# Altium schematic sheet 19_SOLENOID_HB_2.SchDoc
size 420 x 297 mm; SheetNumber: 32; SheetTotal: 36
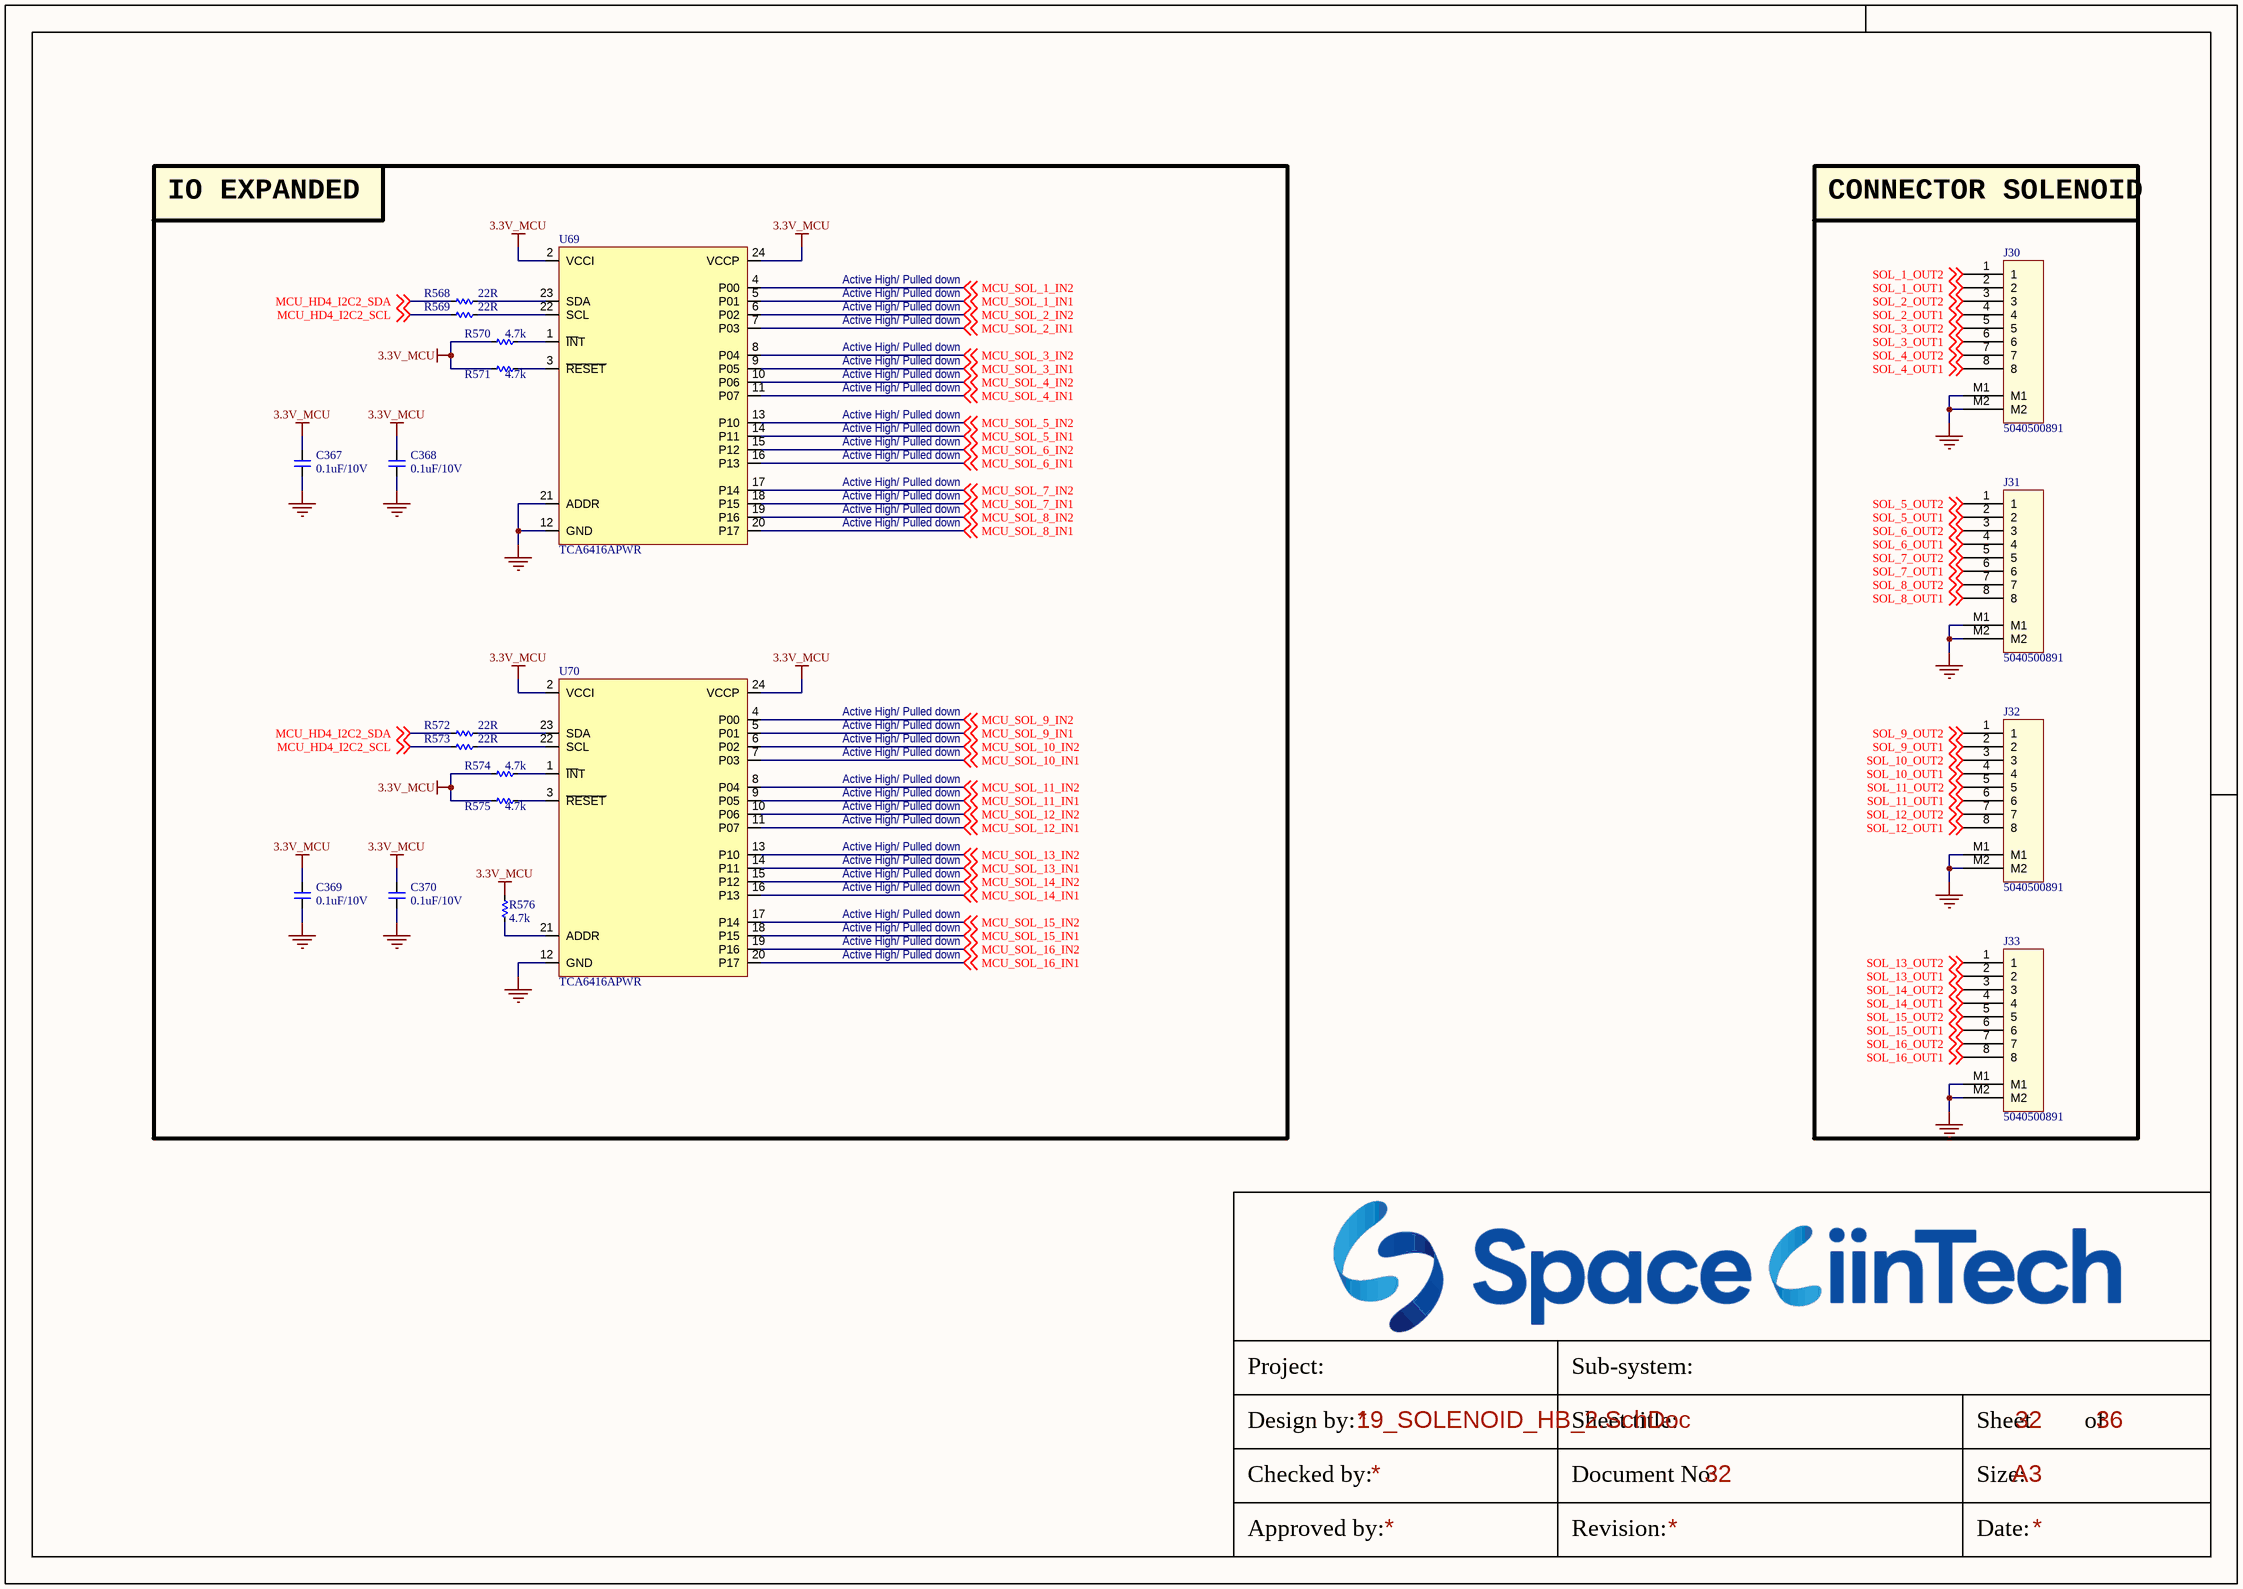
[diagram p0: 19_SOLENOID_HB_2.SchDoc]

## Parts
C367  0.1uF/10V  [CAP_C_1005X50_L]
C368  0.1uF/10V  [CAP_C_1005X50_L]
C369  0.1uF/10V  [CAP_C_1005X50_L]
C370  0.1uF/10V  [CAP_C_1005X50_L]
J30  5040500891  [MOLEX_5040500891]
J31  5040500891  [MOLEX_5040500891]
J32  5040500891  [MOLEX_5040500891]
J33  5040500891  [MOLEX_5040500891]
R568  22R  [RES_C_1005x30_L]
R569  22R  [RES_C_1005x30_L]
R570  4.7k  [RES_C_1005x30_L]
R571  4.7k  [RES_C_1005x30_L]
R572  22R  [RES_C_1005x30_L]
R573  22R  [RES_C_1005x30_L]
R574  4.7k  [RES_C_1005x30_L]
R575  4.7k  [RES_C_1005x30_L]
R576  4.7k  [RES_C_1005x30_L]
U69  TCA6416APWR  [SOP65P440W-24N]
U70  TCA6416APWR  [SOP65P440W-24N]

## Blocks framed on the sheet
IO EXPANDED: C367-C370 R568-R576 U69 U70
CONNECTOR SOLENOID: J30-J33

## Nets
3.3V_MCU: C367.2 C368.2 C369.2 C370.2 R570.1 R571.1 R574.1 R575.1 R576.2 U69.2(VCCI) U69.24(VCCP) U70.2(VCCI) U70.24(VCCP)
GND: C367.1 C368.1 C369.1 C370.1 J30.M1 J30.M2 J31.M1 J31.M2 J32.M1 J32.M2 J33.M1 J33.M2 U69.12(GND) U69.21(ADDR) U70.12(GND)
MCU_HD4_I2C2_SCL: R569.1 R573.1 ; off-sheet MCU_HD4_I2C2_SCL
MCU_HD4_I2C2_SDA: R568.1 R572.1 ; off-sheet MCU_HD4_I2C2_SDA
MCU_SOL_1_IN1: U69.5(P01) ; off-sheet MCU_SOL_1_IN1
MCU_SOL_1_IN2: U69.4(P00) ; off-sheet MCU_SOL_1_IN2
MCU_SOL_2_IN1: U69.7(P03) ; off-sheet MCU_SOL_2_IN1
MCU_SOL_2_IN2: U69.6(P02) ; off-sheet MCU_SOL_2_IN2
MCU_SOL_3_IN1: U69.9(P05) ; off-sheet MCU_SOL_3_IN1
MCU_SOL_3_IN2: U69.8(P04) ; off-sheet MCU_SOL_3_IN2
MCU_SOL_4_IN1: U69.11(P07) ; off-sheet MCU_SOL_4_IN1
MCU_SOL_4_IN2: U69.10(P06) ; off-sheet MCU_SOL_4_IN2
MCU_SOL_5_IN1: U69.14(P11) ; off-sheet MCU_SOL_5_IN1
MCU_SOL_5_IN2: U69.13(P10) ; off-sheet MCU_SOL_5_IN2
MCU_SOL_6_IN1: U69.16(P13) ; off-sheet MCU_SOL_6_IN1
MCU_SOL_6_IN2: U69.15(P12) ; off-sheet MCU_SOL_6_IN2
MCU_SOL_7_IN1: U69.18(P15) ; off-sheet MCU_SOL_7_IN1
MCU_SOL_7_IN2: U69.17(P14) ; off-sheet MCU_SOL_7_IN2
MCU_SOL_8_IN1: U69.20(P17) ; off-sheet MCU_SOL_8_IN1
MCU_SOL_8_IN2: U69.19(P16) ; off-sheet MCU_SOL_8_IN2
MCU_SOL_9_IN1: U70.5(P01) ; off-sheet MCU_SOL_9_IN1
MCU_SOL_9_IN2: U70.4(P00) ; off-sheet MCU_SOL_9_IN2
MCU_SOL_10_IN1: U70.7(P03) ; off-sheet MCU_SOL_10_IN1
MCU_SOL_10_IN2: U70.6(P02) ; off-sheet MCU_SOL_10_IN2
MCU_SOL_11_IN1: U70.9(P05) ; off-sheet MCU_SOL_11_IN1
MCU_SOL_11_IN2: U70.8(P04) ; off-sheet MCU_SOL_11_IN2
MCU_SOL_12_IN1: U70.11(P07) ; off-sheet MCU_SOL_12_IN1
MCU_SOL_12_IN2: U70.10(P06) ; off-sheet MCU_SOL_12_IN2
MCU_SOL_13_IN1: U70.14(P11) ; off-sheet MCU_SOL_13_IN1
MCU_SOL_13_IN2: U70.13(P10) ; off-sheet MCU_SOL_13_IN2
MCU_SOL_14_IN1: U70.16(P13) ; off-sheet MCU_SOL_14_IN1
MCU_SOL_14_IN2: U70.15(P12) ; off-sheet MCU_SOL_14_IN2
MCU_SOL_15_IN1: U70.18(P15) ; off-sheet MCU_SOL_15_IN1
MCU_SOL_15_IN2: U70.17(P14) ; off-sheet MCU_SOL_15_IN2
MCU_SOL_16_IN1: U70.20(P17) ; off-sheet MCU_SOL_16_IN1
MCU_SOL_16_IN2: U70.19(P16) ; off-sheet MCU_SOL_16_IN2
SOL_1_OUT1: J30.2 ; off-sheet SOL_1_OUT1
SOL_1_OUT2: J30.1 ; off-sheet SOL_1_OUT2
SOL_2_OUT1: J30.4 ; off-sheet SOL_2_OUT1
SOL_2_OUT2: J30.3 ; off-sheet SOL_2_OUT2
SOL_3_OUT1: J30.6 ; off-sheet SOL_3_OUT1
SOL_3_OUT2: J30.5 ; off-sheet SOL_3_OUT2
SOL_4_OUT1: J30.8 ; off-sheet SOL_4_OUT1
SOL_4_OUT2: J30.7 ; off-sheet SOL_4_OUT2
SOL_5_OUT1: J31.2 ; off-sheet SOL_5_OUT1
SOL_5_OUT2: J31.1 ; off-sheet SOL_5_OUT2
SOL_6_OUT1: J31.4 ; off-sheet SOL_6_OUT1
SOL_6_OUT2: J31.3 ; off-sheet SOL_6_OUT2
SOL_7_OUT1: J31.6 ; off-sheet SOL_7_OUT1
SOL_7_OUT2: J31.5 ; off-sheet SOL_7_OUT2
SOL_8_OUT1: J31.8 ; off-sheet SOL_8_OUT1
SOL_8_OUT2: J31.7 ; off-sheet SOL_8_OUT2
SOL_9_OUT1: J32.2 ; off-sheet SOL_9_OUT1
SOL_9_OUT2: J32.1 ; off-sheet SOL_9_OUT2
SOL_10_OUT1: J32.4 ; off-sheet SOL_10_OUT1
SOL_10_OUT2: J32.3 ; off-sheet SOL_10_OUT2
SOL_11_OUT1: J32.6 ; off-sheet SOL_11_OUT1
SOL_11_OUT2: J32.5 ; off-sheet SOL_11_OUT2
SOL_12_OUT1: J32.8 ; off-sheet SOL_12_OUT1
SOL_12_OUT2: J32.7 ; off-sheet SOL_12_OUT2
SOL_13_OUT1: J33.2 ; off-sheet SOL_13_OUT1
SOL_13_OUT2: J33.1 ; off-sheet SOL_13_OUT2
SOL_14_OUT1: J33.4 ; off-sheet SOL_14_OUT1
SOL_14_OUT2: J33.3 ; off-sheet SOL_14_OUT2
SOL_15_OUT1: J33.6 ; off-sheet SOL_15_OUT1
SOL_15_OUT2: J33.5 ; off-sheet SOL_15_OUT2
SOL_16_OUT1: J33.8 ; off-sheet SOL_16_OUT1
SOL_16_OUT2: J33.7 ; off-sheet SOL_16_OUT2
NetR568_2: R568.2 U69.23(SDA)
NetR569_2: R569.2 U69.22(SCL)
NetR570_2: R570.2 U69.1(~{IN}T)
NetR571_2: R571.2 U69.3(~{RESET})
NetR572_2: R572.2 U70.23(SDA)
NetR573_2: R573.2 U70.22(SCL)
NetR574_2: R574.2 U70.1(~{IN}T)
NetR575_2: R575.2 U70.3(~{RESET})
NetR576_1: R576.1 U70.21(ADDR)

## Notes on the sheet
- Active High/ Pulled down
- Project:
- Sub-system:
- Design by:
- Sheet title:
- Sheet
- of
- Checked by:
- Approved by:
- Revision:
- Document No:
- Size:
- Date:
- A3

## Library data of the parts
C367-C370 = _CAP_C_2: CAP
J30-J33 = Header 8x1_2M
R568-R576 = _RES_B_2: RES
U69 U70 = IC_I2Cto16IO_TCA6416APWR